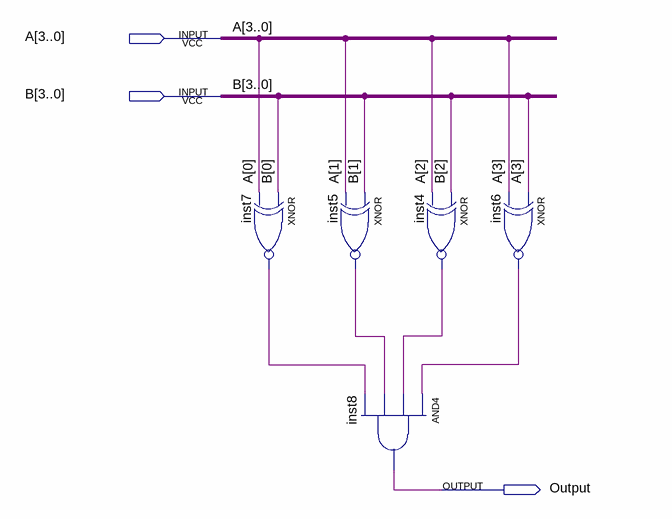
[diagram p0: schematic sheet]
// Quartus schematic Igual.bdf as structural Verilog: 5 symbols, 3 pins
module Igual (
  input  [3:0] A,
  input  [3:0] B,
  output Output
);

  wire inst4_out, inst5_out, inst6_out, inst7_out;

  xnor inst7 (inst7_out, B[0], A[0]);
  xnor inst5 (inst5_out, B[1], A[1]);
  and inst8 (Output, inst6_out, inst4_out, inst5_out, inst7_out);
  xnor inst4 (inst4_out, B[2], A[2]);
  xnor inst6 (inst6_out, A[3], A[3]);
endmodule
